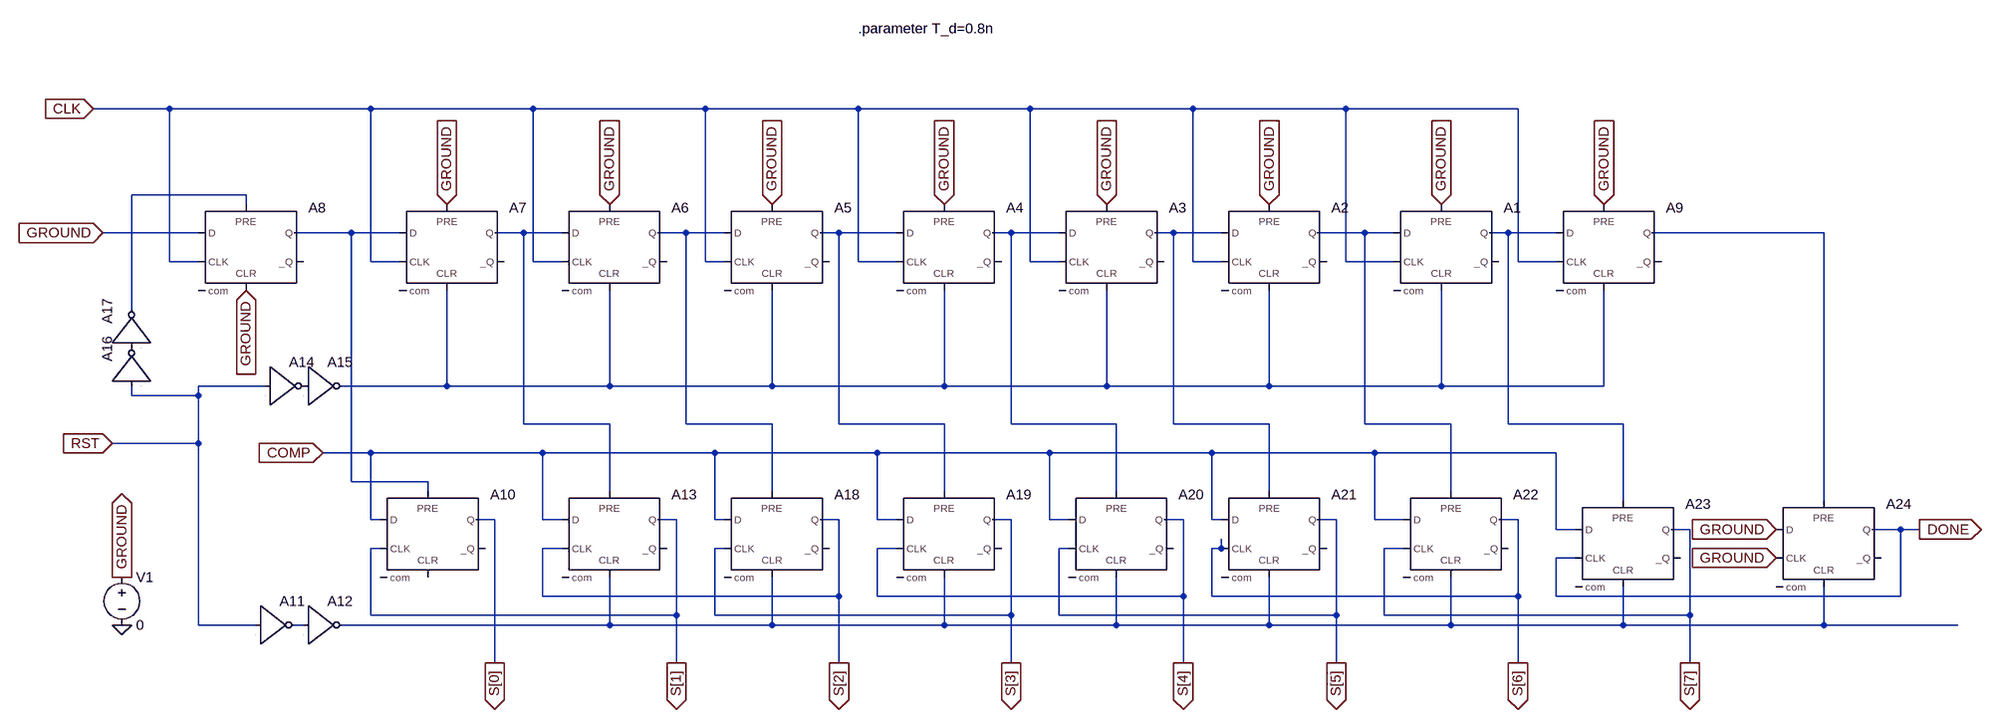
[diagram p0: schematic SAR_LOGIC.asc]
SAR_LOGIC.asc, the LTspice schematic file:
Version 4
SHEET 1 1752 752
WIRE -1664 -368 -1792 -368
WIRE -1328 -368 -1664 -368
WIRE -1056 -368 -1328 -368
WIRE -768 -368 -1056 -368
WIRE -512 -368 -768 -368
WIRE -224 -368 -512 -368
WIRE 48 -368 -224 -368
WIRE 304 -368 48 -368
WIRE 592 -368 304 -368
WIRE -1536 -224 -1728 -224
WIRE -1536 -208 -1536 -224
WIRE -1616 -160 -1776 -160
WIRE -1360 -160 -1456 -160
WIRE -1280 -160 -1360 -160
WIRE -1072 -160 -1120 -160
WIRE -1008 -160 -1072 -160
WIRE -800 -160 -848 -160
WIRE -736 -160 -800 -160
WIRE -544 -160 -576 -160
WIRE -448 -160 -544 -160
WIRE -256 -160 -288 -160
WIRE -176 -160 -256 -160
WIRE 16 -160 -16 -160
WIRE 96 -160 16 -160
WIRE 336 -160 256 -160
WIRE 384 -160 336 -160
WIRE 576 -160 544 -160
WIRE 656 -160 576 -160
WIRE 1104 -160 816 -160
WIRE -1664 -112 -1664 -368
WIRE -1616 -112 -1664 -112
WIRE -1328 -112 -1328 -368
WIRE -1280 -112 -1328 -112
WIRE -1056 -112 -1056 -368
WIRE -1008 -112 -1056 -112
WIRE -768 -112 -768 -368
WIRE -736 -112 -768 -112
WIRE -512 -112 -512 -368
WIRE -448 -112 -512 -112
WIRE -224 -112 -224 -368
WIRE -176 -112 -224 -112
WIRE 48 -112 48 -368
WIRE 96 -112 48 -112
WIRE 304 -112 304 -368
WIRE 384 -112 304 -112
WIRE 592 -112 592 -368
WIRE 656 -112 592 -112
WIRE -1728 -32 -1728 -224
WIRE -1504 96 -1616 96
WIRE -1200 96 -1200 -64
WIRE -1200 96 -1376 96
WIRE -928 96 -928 -64
WIRE -928 96 -1200 96
WIRE -656 96 -656 -64
WIRE -656 96 -928 96
WIRE -368 96 -368 -64
WIRE -368 96 -656 96
WIRE -96 96 -96 -64
WIRE -96 96 -368 96
WIRE 176 96 176 -64
WIRE 176 96 -96 96
WIRE 464 96 464 -64
WIRE 464 96 176 96
WIRE 736 96 736 -64
WIRE 736 96 464 96
WIRE -1728 112 -1728 96
WIRE -1616 112 -1616 96
WIRE -1616 112 -1728 112
WIRE -1072 160 -1072 -160
WIRE -928 160 -1072 160
WIRE -800 160 -800 -160
WIRE -656 160 -800 160
WIRE -544 160 -544 -160
WIRE -368 160 -544 160
WIRE -256 160 -256 -160
WIRE -80 160 -256 160
WIRE 16 160 16 -160
WIRE 176 160 16 160
WIRE 336 160 336 -160
WIRE 480 160 336 160
WIRE 576 160 576 -160
WIRE 768 160 576 160
WIRE -1616 192 -1616 112
WIRE -1616 192 -1760 192
WIRE -1328 208 -1408 208
WIRE -1040 208 -1328 208
WIRE -752 208 -1040 208
WIRE -480 208 -752 208
WIRE -192 208 -480 208
WIRE 80 208 -192 208
WIRE 352 208 80 208
WIRE 656 208 352 208
WIRE -1360 256 -1360 -160
WIRE -1232 256 -1360 256
WIRE -1232 272 -1232 256
WIRE -928 272 -928 160
WIRE -656 272 -656 160
WIRE -368 272 -368 160
WIRE -80 272 -80 160
WIRE 176 272 176 160
WIRE 480 272 480 160
WIRE 768 288 768 160
WIRE 1104 288 1104 -160
WIRE -1328 320 -1328 208
WIRE -1312 320 -1328 320
WIRE -1120 320 -1152 320
WIRE -1040 320 -1040 208
WIRE -1008 320 -1040 320
WIRE -816 320 -848 320
WIRE -752 320 -752 208
WIRE -736 320 -752 320
WIRE -544 320 -576 320
WIRE -480 320 -480 208
WIRE -448 320 -480 320
WIRE -256 320 -288 320
WIRE -192 320 -192 208
WIRE -160 320 -192 320
WIRE 32 320 0 320
WIRE 80 320 80 208
WIRE 96 320 80 320
WIRE 288 320 256 320
WIRE 352 320 352 208
WIRE 400 320 352 320
WIRE 592 320 560 320
WIRE 656 336 656 208
WIRE 688 336 656 336
WIRE 880 336 848 336
WIRE 1232 336 1184 336
WIRE 1264 336 1232 336
WIRE -1312 368 -1328 368
WIRE -1008 368 -1040 368
WIRE -736 368 -752 368
WIRE -448 368 -480 368
WIRE -160 368 -176 368
WIRE 96 368 96 352
WIRE 96 368 80 368
WIRE 400 368 368 368
WIRE 688 384 656 384
WIRE -1040 448 -1040 368
WIRE -544 448 -544 320
WIRE -544 448 -1040 448
WIRE -480 448 -480 368
WIRE 32 448 32 320
WIRE 32 448 -480 448
WIRE 80 448 80 368
WIRE 592 448 592 320
WIRE 592 448 80 448
WIRE 656 448 656 384
WIRE 1232 448 1232 336
WIRE 1232 448 656 448
WIRE -1328 480 -1328 368
WIRE -816 480 -816 320
WIRE -816 480 -1328 480
WIRE -752 480 -752 368
WIRE -256 480 -256 320
WIRE -256 480 -752 480
WIRE -176 480 -176 368
WIRE 288 480 288 320
WIRE 288 480 -176 480
WIRE 368 480 368 368
WIRE 880 480 880 336
WIRE 880 480 368 480
WIRE -1616 496 -1616 192
WIRE -1520 496 -1616 496
WIRE -1440 496 -1456 496
WIRE -928 496 -928 416
WIRE -928 496 -1376 496
WIRE -656 496 -656 416
WIRE -656 496 -928 496
WIRE -368 496 -368 416
WIRE -368 496 -656 496
WIRE -80 496 -80 416
WIRE -80 496 -368 496
WIRE 176 496 176 416
WIRE 176 496 -80 496
WIRE 480 496 480 416
WIRE 480 496 176 496
WIRE 768 496 768 432
WIRE 768 496 480 496
WIRE 1104 496 1104 432
WIRE 1104 496 768 496
WIRE 1328 496 1104 496
WIRE -1120 560 -1120 320
WIRE -816 560 -816 480
WIRE -544 560 -544 448
WIRE -256 560 -256 480
WIRE 32 560 32 448
WIRE 288 560 288 480
WIRE 592 560 592 448
WIRE 880 560 880 480
FLAG -1408 208 COMP
IOPIN -1408 208 In
FLAG -1792 -368 CLK
IOPIN -1792 -368 In
FLAG -1760 192 RST
IOPIN -1760 192 In
FLAG 1264 336 DONE
IOPIN 1264 336 Out
FLAG 880 560 S[7]
IOPIN 880 560 Out
FLAG 592 560 S[6]
IOPIN 592 560 Out
FLAG 288 560 S[5]
IOPIN 288 560 Out
FLAG 32 560 S[4]
IOPIN 32 560 Out
FLAG -256 560 S[3]
IOPIN -256 560 Out
FLAG -544 560 S[2]
IOPIN -544 560 Out
FLAG -816 560 S[1]
IOPIN -816 560 Out
FLAG -1120 560 S[0]
IOPIN -1120 560 Out
FLAG -1744 496 0
FLAG -1744 416 GROUND
IOPIN -1744 416 Out
FLAG -1776 -160 GROUND
IOPIN -1776 -160 In
FLAG -1200 -208 GROUND
IOPIN -1200 -208 In
FLAG -928 -208 GROUND
IOPIN -928 -208 In
FLAG -656 -208 GROUND
IOPIN -656 -208 In
FLAG -368 -208 GROUND
IOPIN -368 -208 In
FLAG -96 -208 GROUND
IOPIN -96 -208 In
FLAG 176 -208 GROUND
IOPIN 176 -208 In
FLAG 464 -208 GROUND
IOPIN 464 -208 In
FLAG 736 -208 GROUND
IOPIN 736 -208 In
FLAG -1536 -64 GROUND
IOPIN -1536 -64 In
FLAG 1024 336 GROUND
IOPIN 1024 336 In
FLAG 1024 384 GROUND
IOPIN 1024 384 In
SYMBOL voltage -1744 400 R0
SYMATTR InstName V1
SYMATTR Value 0
SYMBOL Digital\\dflop 736 -208 R0
SYMATTR InstName A9
SYMATTR SpiceLine td={T_d}
SYMBOL Digital\\inv -1520 432 R0
SYMATTR InstName A11
SYMATTR SpiceLine td = 1p
SYMBOL Digital\\inv -1440 432 R0
SYMATTR InstName A12
SYMATTR SpiceLine td=1p
SYMBOL Digital\\inv -1504 32 R0
SYMATTR InstName A14
SYMATTR SpiceLine td=1p
SYMBOL Digital\\inv -1440 32 R0
SYMATTR InstName A15
SYMATTR SpiceLine td=1p
SYMBOL Digital\\inv -1792 96 R270
SYMATTR InstName A16
SYMATTR SpiceLine td=1p
SYMBOL Digital\\inv -1792 32 R270
SYMATTR InstName A17
SYMATTR SpiceLine td=1p
SYMBOL Digital\\dflop 464 -208 R0
SYMATTR InstName A1
SYMATTR SpiceLine td={T_d}
SYMBOL Digital\\dflop 176 -208 R0
SYMATTR InstName A2
SYMATTR SpiceLine td={T_d}
SYMBOL Digital\\dflop -96 -208 R0
SYMATTR InstName A3
SYMATTR SpiceLine td={T_d}
SYMBOL Digital\\dflop -368 -208 R0
SYMATTR InstName A4
SYMATTR SpiceLine td={T_d}
SYMBOL Digital\\dflop -656 -208 R0
SYMATTR InstName A5
SYMATTR SpiceLine td={T_d}
SYMBOL Digital\\dflop -928 -208 R0
SYMATTR InstName A6
SYMATTR SpiceLine td={T_d}
SYMBOL Digital\\dflop -1200 -208 R0
SYMATTR InstName A7
SYMATTR SpiceLine td={T_d}
SYMBOL Digital\\dflop -1536 -208 R0
SYMATTR InstName A8
SYMATTR SpiceLine td={T_d}
SYMBOL Digital\\dflop -1232 272 R0
SYMATTR InstName A10
SYMATTR SpiceLine td={T_d}
SYMBOL Digital\\dflop -928 272 R0
SYMATTR InstName A13
SYMATTR SpiceLine td={T_d}
SYMBOL Digital\\dflop -656 272 R0
SYMATTR InstName A18
SYMATTR SpiceLine td={T_d}
SYMBOL Digital\\dflop -368 272 R0
SYMATTR InstName A19
SYMATTR SpiceLine td={T_d}
SYMBOL Digital\\dflop -80 272 R0
SYMATTR InstName A20
SYMATTR SpiceLine td={T_d}
SYMBOL Digital\\dflop 176 272 R0
SYMATTR InstName A21
SYMATTR SpiceLine td={T_d}
SYMBOL Digital\\dflop 480 272 R0
SYMATTR InstName A22
SYMATTR SpiceLine td={T_d}
SYMBOL Digital\\dflop 768 288 R0
SYMATTR InstName A23
SYMATTR SpiceLine td={T_d}
SYMBOL Digital\\dflop 1104 288 R0
SYMATTR InstName A24
SYMATTR SpiceLine td={T_d}
TEXT -512 -504 Left 2 !.parameter T_d=0.8n

The netlist it stands for:
* SAR_LOGIC.asc
V1 GROUND 0 0
A9 N009 0 CLK GROUND N011 0 N010 0 DFLOP td={T_d}
A11 RST 0 0 0 0 N012 0 0 BUF td = 1p
A12 N012 0 0 0 0 N013 0 0 BUF td=1p
A14 RST 0 0 0 0 P001 0 0 BUF td=1p
A15 P001 0 0 0 0 N011 0 0 BUF td=1p
A16 RST 0 0 0 0 P002 0 0 BUF td=1p
A17 P002 0 0 0 0 N001 0 0 BUF td=1p
A1 N008 0 CLK GROUND N011 0 N009 0 DFLOP td={T_d}
A2 N007 0 CLK GROUND N011 0 N008 0 DFLOP td={T_d}
A3 N006 0 CLK GROUND N011 0 N007 0 DFLOP td={T_d}
A4 N005 0 CLK GROUND N011 0 N006 0 DFLOP td={T_d}
A5 N004 0 CLK GROUND N011 0 N005 0 DFLOP td={T_d}
A6 N003 0 CLK GROUND N011 0 N004 0 DFLOP td={T_d}
A7 N002 0 CLK GROUND N011 0 N003 0 DFLOP td={T_d}
A8 GROUND 0 CLK N001 GROUND 0 N002 0 DFLOP td={T_d}
A10 COMP 0 S[1] N002 0 0 S[0] 0 DFLOP td={T_d}
A13 COMP 0 S[2] N003 N013 0 S[1] 0 DFLOP td={T_d}
A18 COMP 0 S[3] N004 N013 0 S[2] 0 DFLOP td={T_d}
A19 COMP 0 S[4] N005 N013 0 S[3] 0 DFLOP td={T_d}
A20 COMP 0 S[5] N006 N013 0 S[4] 0 DFLOP td={T_d}
A21 COMP 0 S[6] N007 N013 0 S[5] 0 DFLOP td={T_d}
A22 COMP 0 S[7] N008 N013 0 S[6] 0 DFLOP td={T_d}
A23 COMP 0 DONE N009 N013 0 S[7] 0 DFLOP td={T_d}
A24 GROUND 0 GROUND N010 N013 0 DONE 0 DFLOP td={T_d}
.parameter T_d=0.8n
.backanno
.end